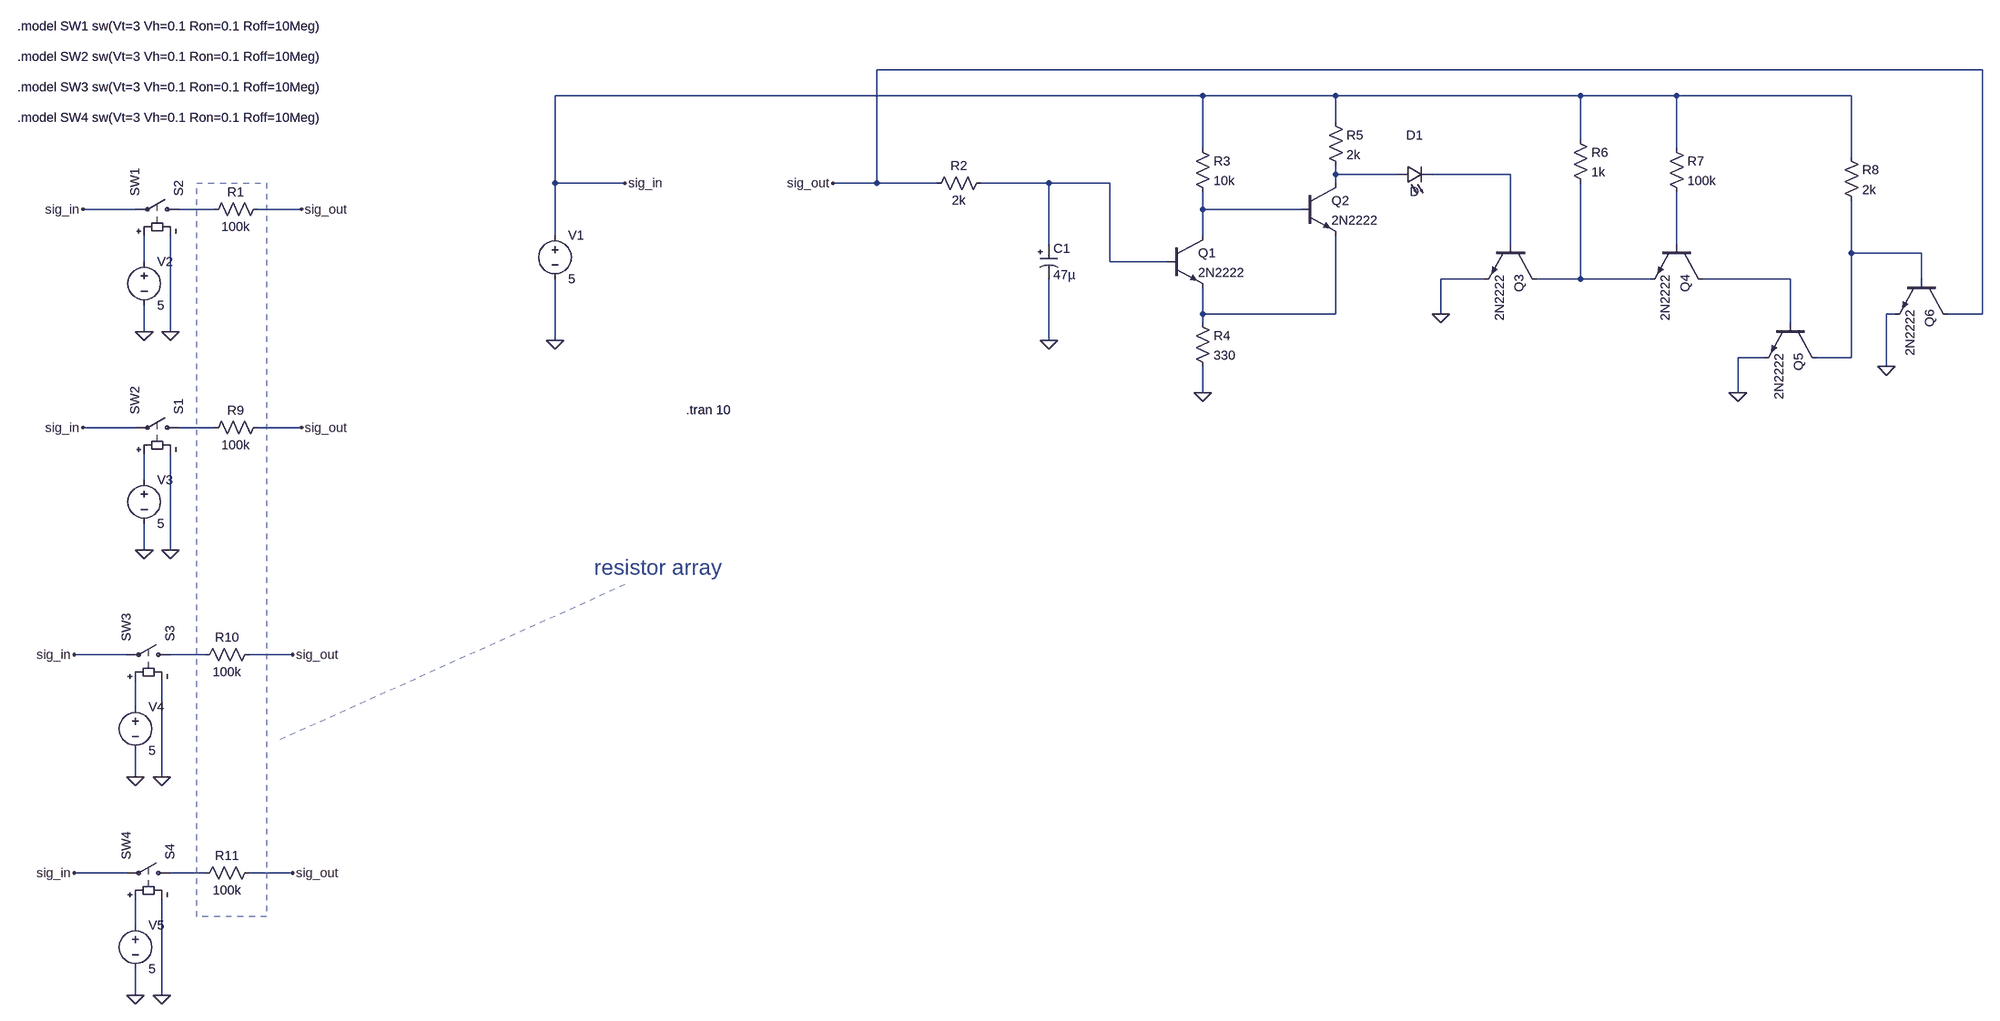
[diagram p0: schematic good_neuron_6.asc]
good_neuron_6.asc, the LTspice schematic file:
Version 4.1
SHEET 1 7320 2680
WIRE 2304 -192 208 -192
WIRE 848 -144 -448 -144
WIRE 1120 -144 848 -144
WIRE 1568 -144 1120 -144
WIRE 1744 -144 1568 -144
WIRE 2064 -144 1744 -144
WIRE 1120 -96 1120 -144
WIRE 1568 -64 1568 -144
WIRE 848 -48 848 -144
WIRE 1744 -48 1744 -144
WIRE 2064 -32 2064 -144
WIRE 1120 0 1120 -16
WIRE 1232 0 1120 0
WIRE 1440 0 1296 0
WIRE -448 16 -448 -144
WIRE -320 16 -448 16
WIRE 208 16 208 -192
WIRE 208 16 128 16
WIRE 320 16 208 16
WIRE 528 16 400 16
WIRE 640 16 528 16
WIRE 1120 16 1120 0
WIRE -1216 64 -1312 64
WIRE -1072 64 -1136 64
WIRE -912 64 -992 64
WIRE 848 64 848 32
WIRE 1056 64 848 64
WIRE -448 112 -448 16
WIRE 848 112 848 64
WIRE 528 128 528 16
WIRE 1440 128 1440 0
WIRE 1744 128 1744 32
WIRE 2064 144 2064 48
WIRE 2192 144 2064 144
WIRE -1200 160 -1200 112
WIRE 640 160 640 16
WIRE 784 160 640 160
WIRE 1392 192 1312 192
WIRE 1568 192 1568 16
WIRE 1568 192 1488 192
WIRE 1696 192 1568 192
WIRE 1952 192 1792 192
WIRE 2192 192 2192 144
WIRE 848 256 848 208
WIRE 1120 256 1120 112
WIRE 1120 256 848 256
WIRE 1312 256 1312 192
WIRE 2144 256 2128 256
WIRE 2304 256 2304 -192
WIRE 2304 256 2240 256
WIRE 848 272 848 256
WIRE 1952 272 1952 192
WIRE -1200 288 -1200 240
WIRE -1152 288 -1152 112
WIRE -448 304 -448 192
WIRE 528 304 528 192
WIRE 1904 336 1856 336
WIRE 2064 336 2064 144
WIRE 2064 336 2000 336
WIRE 2128 352 2128 256
WIRE 848 400 848 352
WIRE 1856 400 1856 336
WIRE -1216 464 -1312 464
WIRE -1072 464 -1136 464
WIRE -912 464 -992 464
WIRE -1200 560 -1200 512
WIRE -1200 688 -1200 640
WIRE -1152 688 -1152 512
WIRE -1232 880 -1328 880
WIRE -1088 880 -1152 880
WIRE -928 880 -1008 880
WIRE -1216 976 -1216 928
WIRE -1216 1104 -1216 1056
WIRE -1168 1104 -1168 928
WIRE -1232 1280 -1328 1280
WIRE -1088 1280 -1152 1280
WIRE -928 1280 -1008 1280
WIRE -1216 1376 -1216 1328
WIRE -1216 1504 -1216 1456
WIRE -1168 1504 -1168 1328
FLAG -448 304 0
FLAG 528 304 0
FLAG 848 400 0
FLAG 1312 256 0
FLAG 1856 400 0
FLAG 2128 352 0
FLAG -320 16 sig_in
FLAG 128 16 sig_out
FLAG -1200 288 0
FLAG -1152 288 0
FLAG -1312 64 sig_in
FLAG -912 64 sig_out
FLAG -1200 688 0
FLAG -1152 688 0
FLAG -1312 464 sig_in
FLAG -912 464 sig_out
FLAG -1216 1104 0
FLAG -1168 1104 0
FLAG -1328 880 sig_in
FLAG -928 880 sig_out
FLAG -1216 1504 0
FLAG -1168 1504 0
FLAG -1328 1280 sig_in
FLAG -928 1280 sig_out
SYMBOL voltage -448 96 R0
WINDOW 123 0 0 Left 0
WINDOW 39 0 0 Left 0
SYMATTR InstName V1
SYMATTR Value 5
SYMBOL res 416 0 R90
WINDOW 0 0 56 VBottom 2
WINDOW 3 32 56 VTop 2
SYMATTR InstName R2
SYMATTR Value 2k
SYMBOL polcap 512 128 R0
SYMATTR InstName C1
SYMATTR Value 47µ
SYMBOL npn 784 112 R0
SYMATTR InstName Q1
SYMATTR Value 2N2222
SYMBOL res 832 -64 R0
SYMATTR InstName R3
SYMATTR Value 10k
SYMBOL res 832 256 R0
SYMATTR InstName R4
SYMATTR Value 330
SYMBOL npn 1056 16 R0
SYMATTR InstName Q2
SYMATTR Value 2N2222
SYMBOL res 1104 -112 R0
SYMATTR InstName R5
SYMATTR Value 2k
SYMBOL LED 1232 16 R270
WINDOW 0 72 32 VTop 2
WINDOW 3 0 32 VBottom 2
SYMATTR InstName D1
SYMBOL npn 1488 128 R90
SYMATTR InstName Q3
SYMATTR Value 2N2222
SYMBOL res 1552 -80 R0
SYMATTR InstName R6
SYMATTR Value 1k
SYMBOL npn 1792 128 R90
SYMATTR InstName Q4
SYMATTR Value 2N2222
SYMBOL res 1728 -64 R0
SYMATTR InstName R7
SYMATTR Value 100k
SYMBOL npn 2000 272 R90
SYMATTR InstName Q5
SYMATTR Value 2N2222
SYMBOL res 2048 -48 R0
SYMATTR InstName R8
SYMATTR Value 2k
SYMBOL npn 2240 192 R90
SYMATTR InstName Q6
SYMATTR Value 2N2222
SYMBOL sw -1120 64 M270
SYMATTR InstName S2
SYMATTR Value SW1
SYMBOL voltage -1200 144 R0
WINDOW 123 0 0 Left 0
WINDOW 39 0 0 Left 0
SYMATTR InstName V2
SYMATTR Value 5
SYMBOL res -976 48 R90
WINDOW 0 0 56 VBottom 2
WINDOW 3 32 56 VTop 2
SYMATTR InstName R1
SYMATTR Value 100k
SYMBOL sw -1120 464 M270
SYMATTR InstName S1
SYMATTR Value SW2
SYMBOL voltage -1200 544 R0
WINDOW 123 0 0 Left 0
WINDOW 39 0 0 Left 0
SYMATTR InstName V3
SYMATTR Value 5
SYMBOL res -976 448 R90
WINDOW 0 0 56 VBottom 2
WINDOW 3 32 56 VTop 2
SYMATTR InstName R9
SYMATTR Value 100k
SYMBOL sw -1136 880 M270
SYMATTR InstName S3
SYMATTR Value SW3
SYMBOL voltage -1216 960 R0
WINDOW 123 0 0 Left 0
WINDOW 39 0 0 Left 0
SYMATTR InstName V4
SYMATTR Value 5
SYMBOL res -992 864 R90
WINDOW 0 0 56 VBottom 2
WINDOW 3 32 56 VTop 2
SYMATTR InstName R10
SYMATTR Value 100k
SYMBOL sw -1136 1280 M270
SYMATTR InstName S4
SYMATTR Value SW4
SYMBOL voltage -1216 1360 R0
WINDOW 123 0 0 Left 0
WINDOW 39 0 0 Left 0
SYMATTR InstName V5
SYMATTR Value 5
SYMBOL res -992 1264 R90
WINDOW 0 0 56 VBottom 2
WINDOW 3 32 56 VTop 2
SYMATTR InstName R11
SYMATTR Value 100k
TEXT -208 432 Left 2 !.tran 10
TEXT -1432 -272 Left 2 !.model SW1 sw(Vt=3 Vh=0.1 Ron=0.1 Roff=10Meg)
TEXT -1432 -216 Left 2 !.model SW2 sw(Vt=3 Vh=0.1 Ron=0.1 Roff=10Meg)
TEXT -1432 -160 Left 2 !.model SW3 sw(Vt=3 Vh=0.1 Ron=0.1 Roff=10Meg)
TEXT -1432 -104 Left 2 !.model SW4 sw(Vt=3 Vh=0.1 Ron=0.1 Roff=10Meg)
TEXT -376 720 Left 4 ;resistor array
LINE Normal -320 752 -960 1040 2
RECTANGLE Normal -976 1360 -1104 16 2

The netlist it stands for:
* good_neuron_6.asc
V1 sig_in 0 5
R2 N003 sig_out 2k
C1 N003 0 47µ
Q1 N005 N003 N011 0 2N2222
R3 sig_in N005 10k
R4 N011 0 330
Q2 N001 N005 N011 0 2N2222
R5 sig_in N001 2k
D1 N001 N002 D
Q3 N009 N002 0 0 2N2222
R6 sig_in N009 1k
Q4 N010 N006 N009 0 2N2222
R7 sig_in N006 100k
Q5 N007 N010 0 0 2N2222
R8 sig_in N007 2k
Q6 sig_out N007 0 0 2N2222
S2 N004 sig_in N008 0 SW1
V2 N008 0 5
R1 sig_out N004 100k
S1 N012 sig_in N013 0 SW2
V3 N013 0 5
R9 sig_out N012 100k
S3 N014 sig_in N015 0 SW3
V4 N015 0 5
R10 sig_out N014 100k
S4 N016 sig_in N017 0 SW4
V5 N017 0 5
R11 sig_out N016 100k
.model D D
.lib standard.dio
.model NPN NPN
.model PNP PNP
.lib standard.bjt
.tran 10
.model SW1 sw(Vt=3 Vh=0.1 Ron=0.1 Roff=10Meg)
.model SW2 sw(Vt=3 Vh=0.1 Ron=0.1 Roff=10Meg)
.model SW3 sw(Vt=3 Vh=0.1 Ron=0.1 Roff=10Meg)
.model SW4 sw(Vt=3 Vh=0.1 Ron=0.1 Roff=10Meg)
* resistor array
.backanno
.end